# EAGLE design IEEE_EXT_Base_Centr (EAGLE 9.6.2)
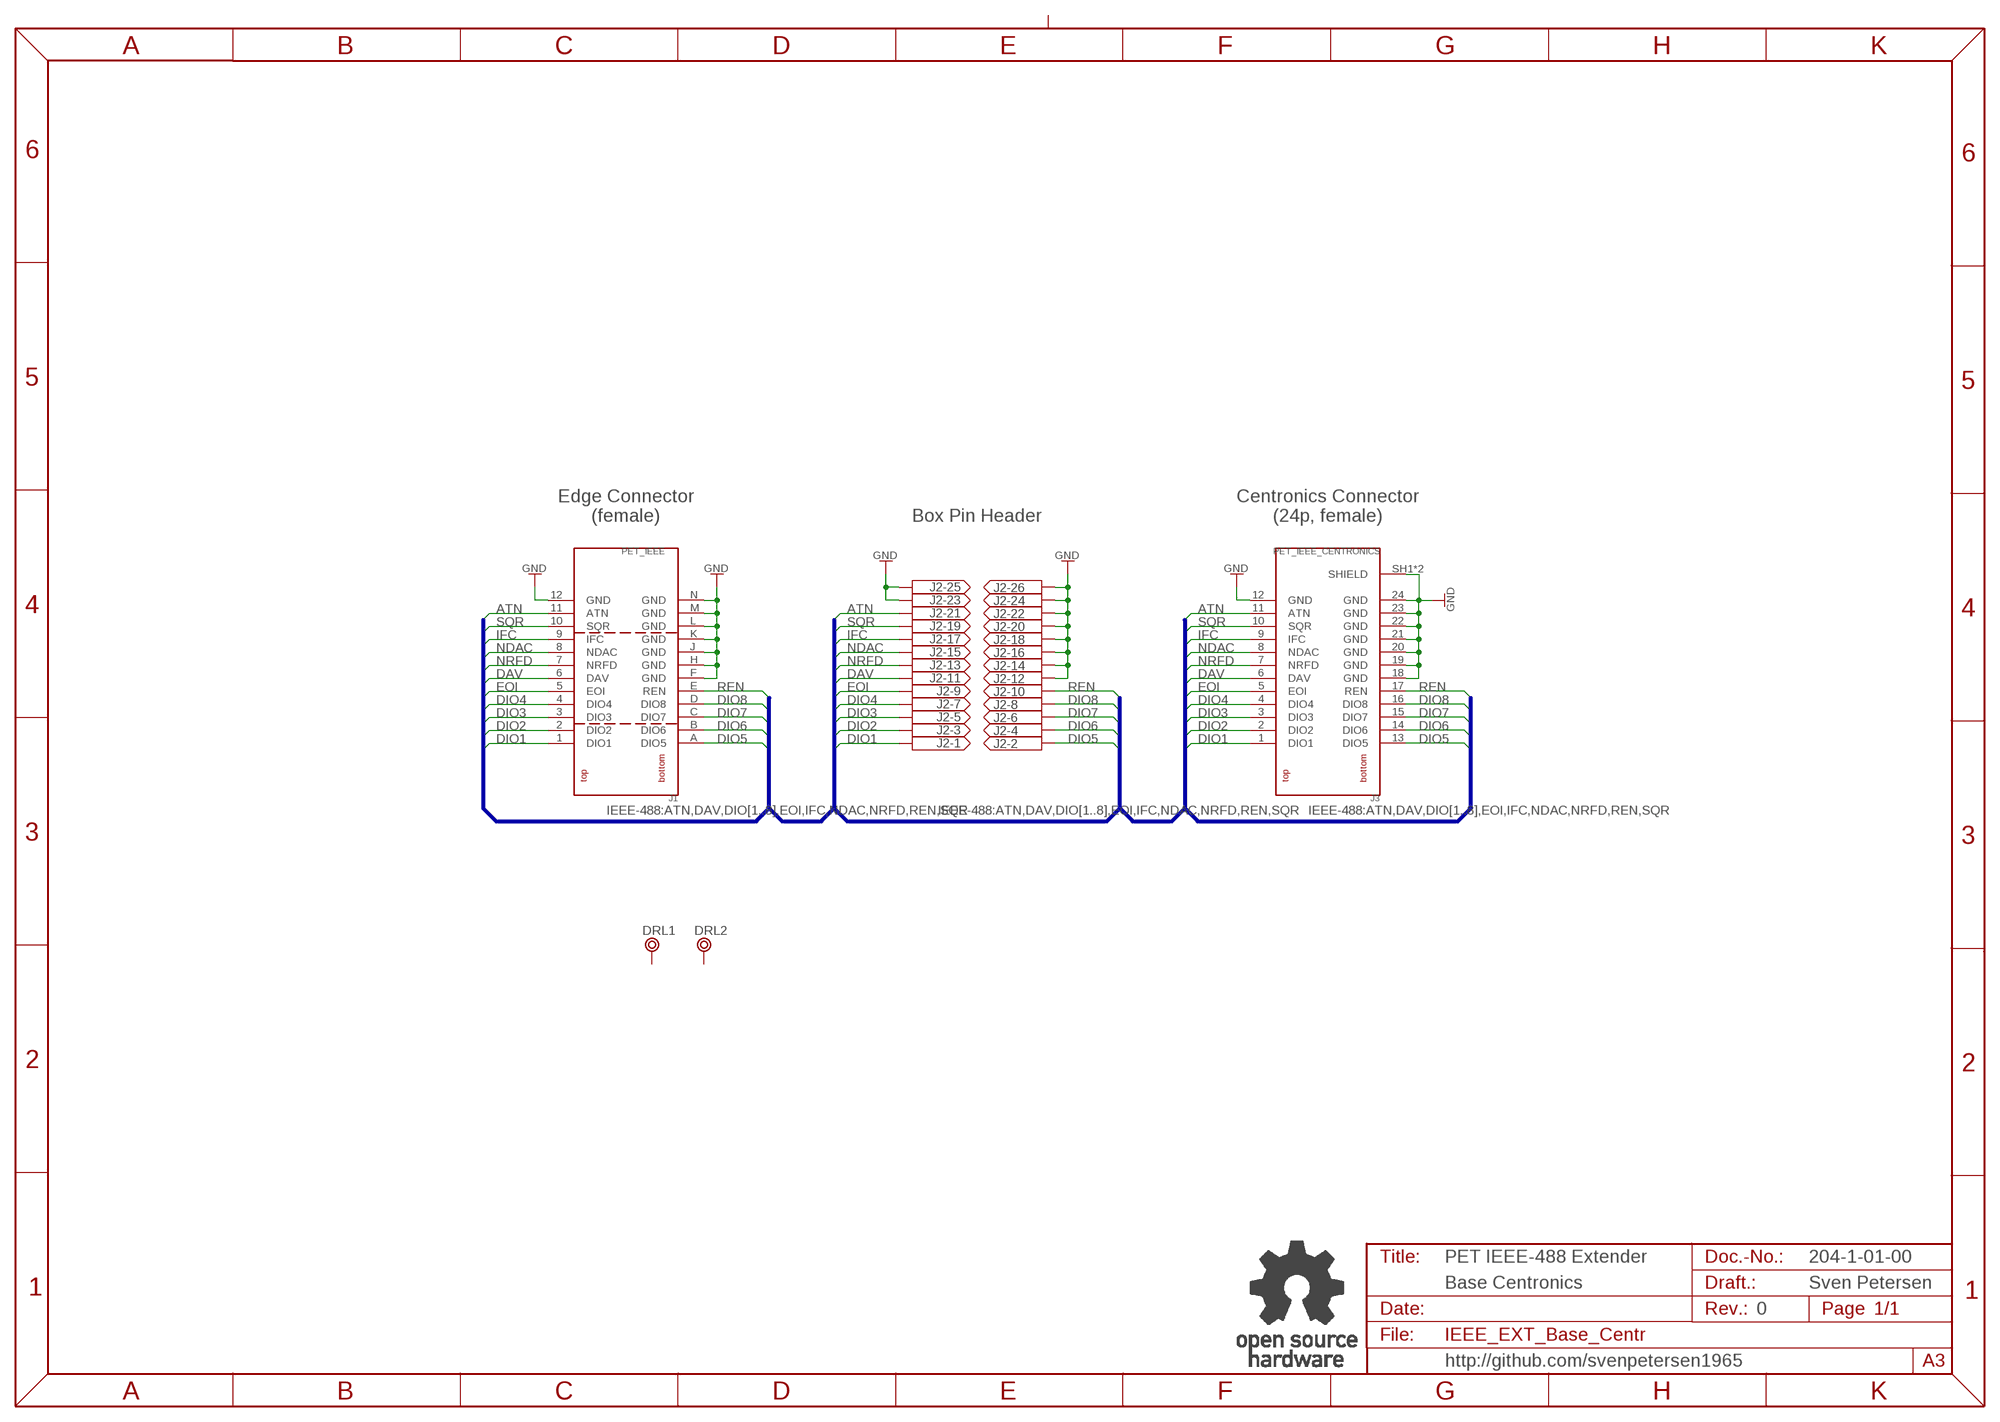
[diagram p0: schematic, sheet 1]

## Parts
DRL1  BOHR3,5  [BOHR3,5]
DRL2  BOHR3,5  [BOHR3,5]
J1  PET_IEEE  [USERPORT]
J2  2X13WANNE  [2X13WV]
J3  PET_IEEE_CENTRONICS  [CENTRONICS24]
U$9  OPEN_SOURCE_HW  [OPENHW]

## Nets
ATN: J1.11(ATN) J2.21 J3.11(ATN)
DAV: J1.6(DAV) J2.11 J3.6(DAV)
DIO1: J1.1(DIO1) J2.1 J3.1(DIO1)
DIO2: J1.2(DIO2) J2.3 J3.2(DIO2)
DIO3: J1.3(DIO3) J2.5 J3.3(DIO3)
DIO4: J1.4(DIO4) J2.7 J3.4(DIO4)
DIO5: J1.A(DIO5) J2.2 J3.13(DIO5)
DIO6: J1.B(DIO6) J2.4 J3.14(DIO6)
DIO7: J1.C(DIO7) J2.6 J3.15(DIO7)
DIO8: J1.D(DIO8) J2.8 J3.16(DIO8)
EOI: J1.5(EOI) J2.9 J3.5(EOI)
GND: J1.12(GND) J1.F(GND) J1.H(GND) J1.J(GND) J1.K(GND) J1.L(GND) J1.M(GND) J1.N(GND) J2.12 J2.14 J2.16 J2.18 J2.20 J2.22 J2.23 J2.24 J2.25 J2.26 J3.12(GND) J3.18(GND) J3.19(GND) J3.20(GND) J3.21(GND) J3.22(GND) J3.23(GND) J3.24(GND) J3.SH1(SHIELD) J3.SH2(SHIELD)
IFC: J1.9(IFC) J2.17 J3.9(IFC)
NDAC: J1.8(NDAC) J2.15 J3.8(NDAC)
NRFD: J1.7(NRFD) J2.13 J3.7(NRFD)
REN: J1.E(REN) J2.10 J3.17(REN)
SQR: J1.10(SQR) J2.19 J3.10(SQR)
Unconnected: DRL1.P$1 DRL2.P$1

## Buses
IEEE-488:ATN,DAV,DIO[1..8],EOI,IFC,NDAC,NRFD,REN,SQR

## Notes on the sheet
- Edge Connector
  (female)
- Box Pin Header
- Centronics Connector
  (24p, female)
- PET IEEE-488 Extender | 204-1-01-00
- Base Centronics | Sven Petersen
- 0
- http://github.com/svenpetersen1965

## Library data of the parts
DRL1 DRL2 = Mech_Bohr:BOHR3,5
J1 = Commodore:PET_IEEE
J2 = PINHEAD:2X13WANNE
J3 = Commodore:PET_IEEE_CENTRONICS
U$9 = Logo:OPEN_SOURCE_HW

## Board
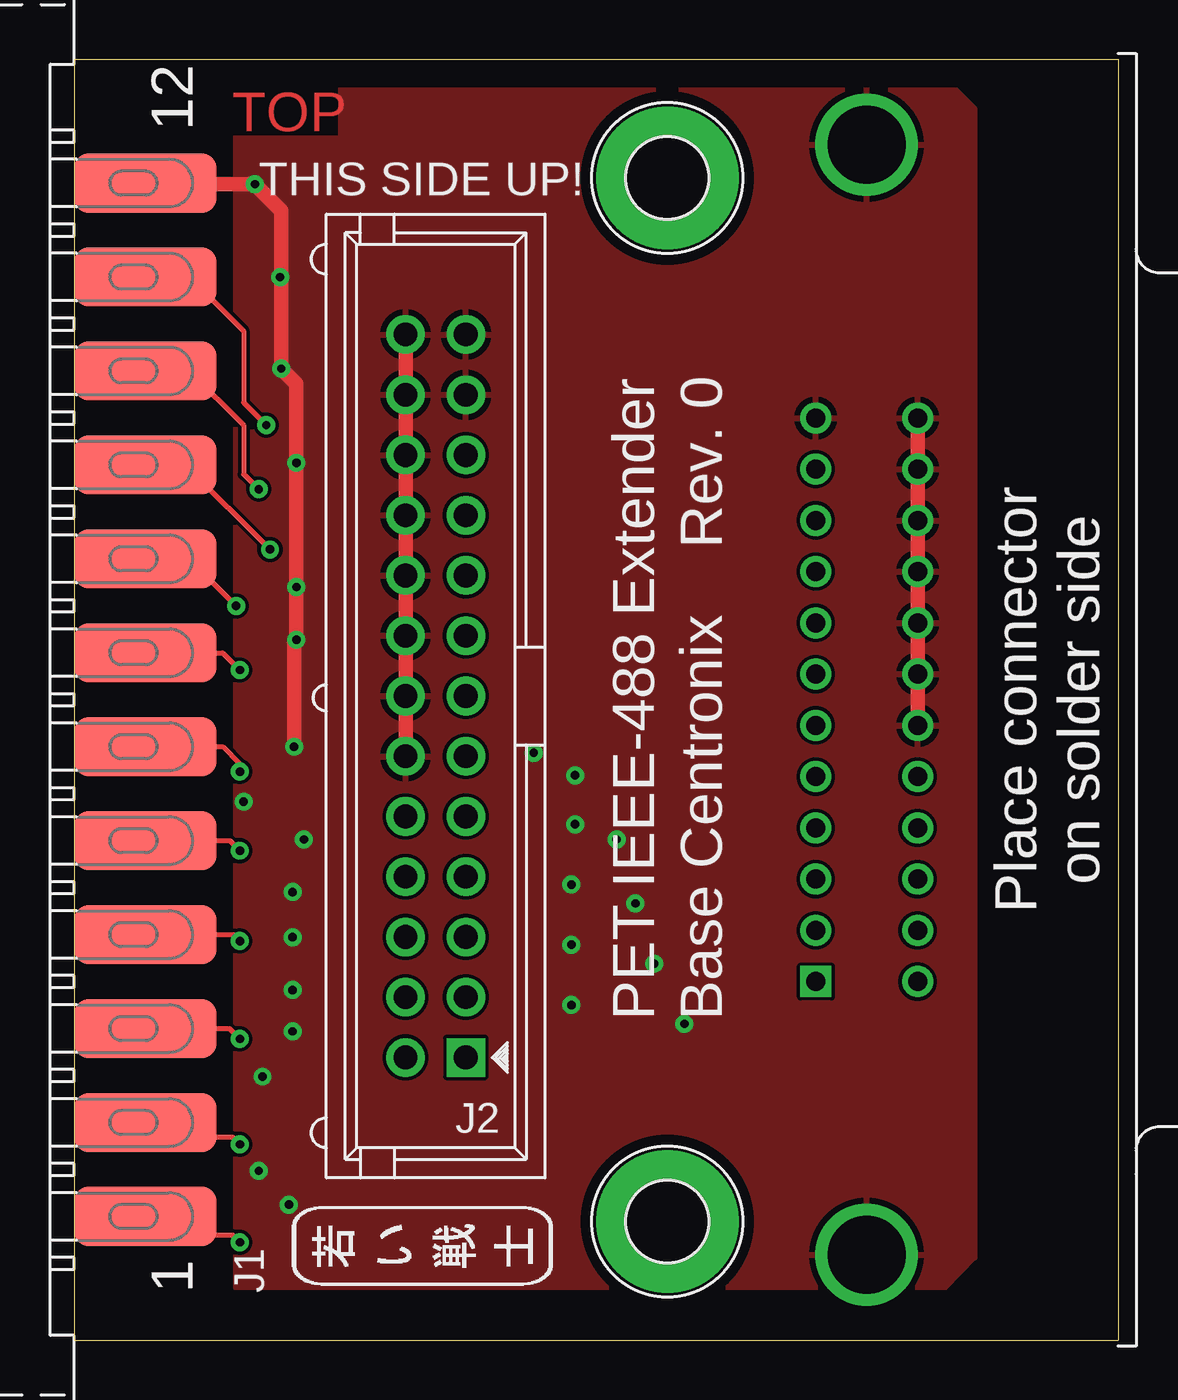
[diagram p1: board, top side]
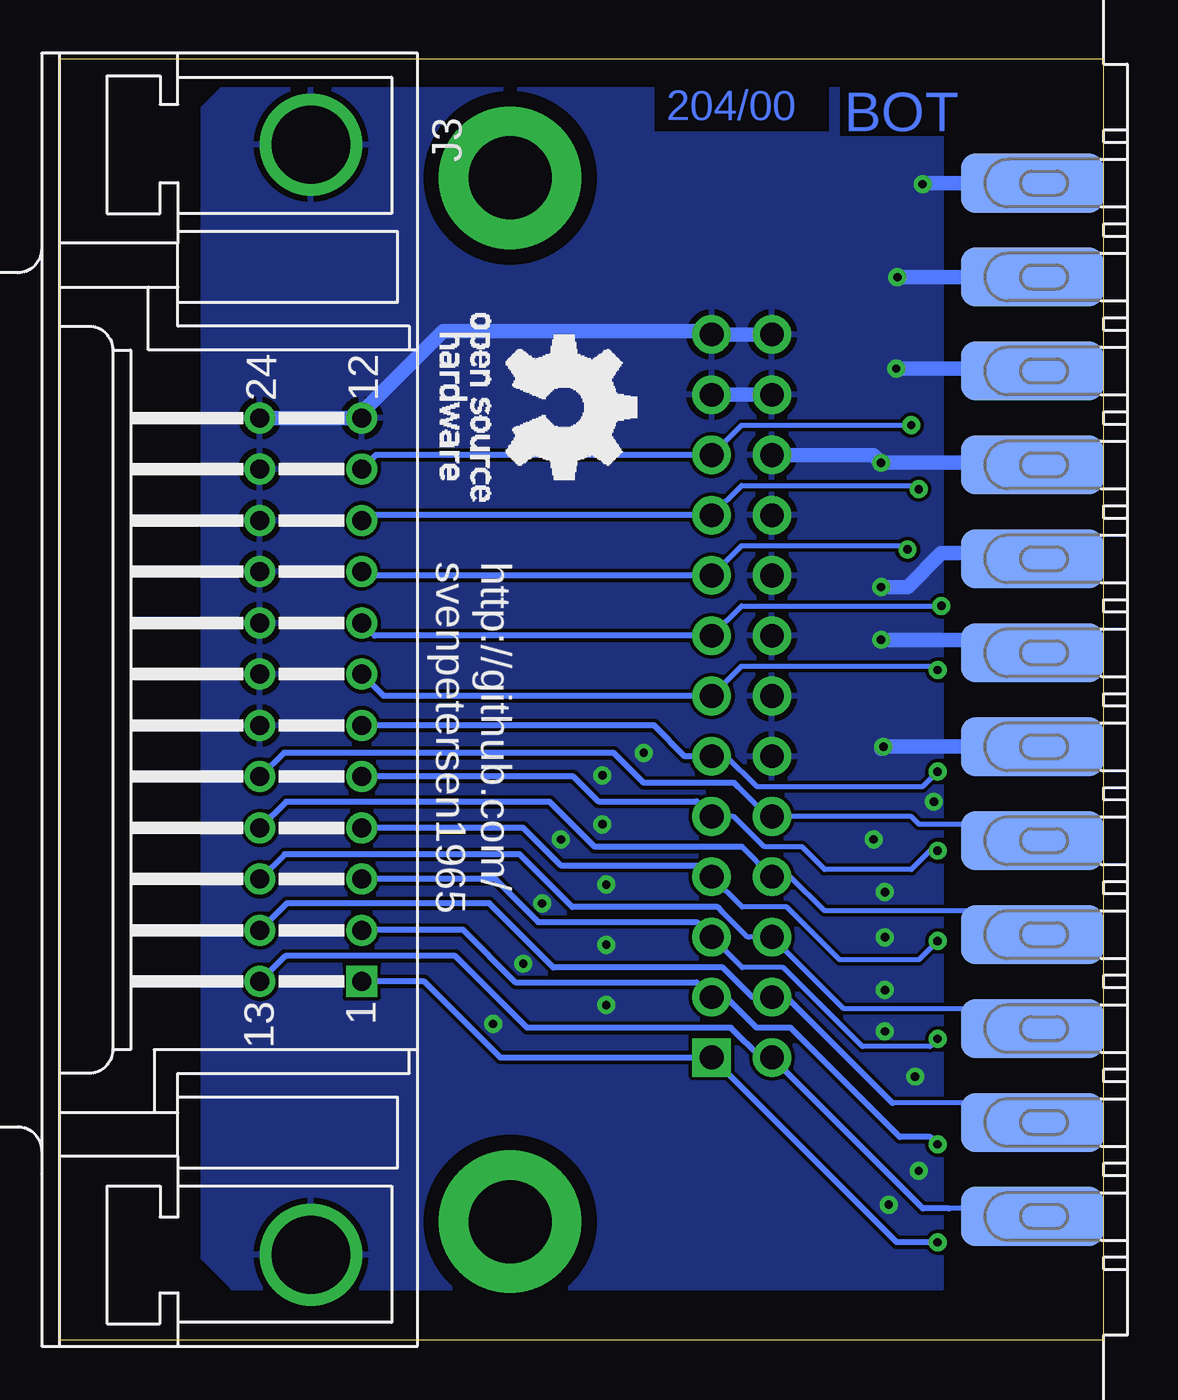
[diagram p2: board, bottom side, seen from below]

Size 44 x 54 mm. Coordinates in mm from the lower left corner, seen from the top.
Outline: 0,0 44,0 44,54 0,54 0,0
Copper layers (1*16): Top 0.035mm / dielectric 1.5mm / Bottom 0.035mm
Design rules "default *": minimum track width 6mil, minimum drill 0.35mm, track to track 6mil, track to pad 6mil, pad to pad 6mil, via to via 6mil, smd to smd 6mil, copper to edge 40mil, drill to drill 6mil, minimum pad ring 10mil, minimum via ring 8mil, stop-mask expansion 4mil, vias tented up to drill 25mil, thermal gap 10mil
bRestrict: 3 lines

### Footprints (pad centres in the part's own frame; a part is rotated, then mirrored left to right if it is on the bottom)
BOHR3,5 = drill 3.5 pad 6: P$1 0,0
USERPORT = smd 2.5 x 6: 1 -21.78,-3; 2 -17.82,-3; 3 -13.86,-3; 4 -9.9,-3; 5 -5.94,-3; 6 -1.98,-3; 7 1.98,-3; 8 5.94,-3; 9 9.9,-3; 10 13.86,-3; 11 17.82,-3; 12 21.78,-3 | smd 2.5 x 6 bottom: A -21.78,-3; B -17.82,-3; C -13.86,-3; D -9.9,-3; E -5.94,-3; F -1.98,-3; H 1.98,-3; J 5.94,-3; K 9.9,-3; L 13.86,-3; M 17.82,-3; N 21.78,-3
2X13WV = drill 1 pad 1.626 square: 1 -15.24,-1.27 | drill 1 pad 1.626: 2 -15.24,1.27; 3 -12.7,-1.27; 4 -12.7,1.27; 5 -10.16,-1.27; 6 -10.16,1.27; 7 -7.62,-1.27; 8 -7.62,1.27; 9 -5.08,-1.27; 10 -5.08,1.27; 11 -2.54,-1.27; 12 -2.54,1.27; 13 0,-1.27; 14 0,1.27; 15 2.54,-1.27; 16 2.54,1.27; 17 5.08,-1.27; 18 5.08,1.27; 19 7.62,-1.27; 20 7.62,1.27; 21 10.16,-1.27; 22 10.16,1.27; 23 12.7,-1.27; 24 12.7,1.27; 25 15.24,-1.27; 26 15.24,1.27
CENTRONICS24 = drill 0.8 square: 1 11.88,12.745 | drill 0.8: 2 9.72,12.745; 3 7.56,12.745; 4 5.4,12.745; 5 3.24,12.745; 6 1.08,12.745; 7 -1.08,12.745; 8 -3.24,12.745; 9 -5.4,12.745; 10 -7.56,12.745; 11 -9.72,12.745; 12 -11.88,12.745; 13 11.88,8.455; 14 9.72,8.455; 15 7.56,8.455; 16 5.4,8.455; 17 3.24,8.455; 18 1.08,8.455; 19 -1.08,8.455; 20 -3.24,8.455; 21 -5.4,8.455; 22 -7.56,8.455; 23 -9.72,8.455; 24 -11.88,8.455 | drill 3.3: SH1 -23.4,10.6; SH2 23.4,10.6

### Placement (x,y rotation side)
DRL1  25,5 0 top
DRL2  25,49 0 top
J1  0,27 90 top
J2  15.24,27.16 90 top
J3  44,27 270 bottom
U$8  [PCB-TITLE/]  0,68.42 0 top  (outside the outline)
U$9  27.95,43.27 270 bottom
U$10  [2LAYER]  6.64,50.96 0 top
U$11  [SVEN_TAG]  14.56,4.01 90 top

### Tracks (layer width: path | path; a pad name or v marks a point on that pad's centre or on a via)
ATN  (via drill 0.35)
  Top 0.203: J1.11 4.87,44.82 7.14,42.55 7.14,39.53 v8.1,38.58
  Bottom 0.203: v8.1,38.58 15.25,38.58 J2.21
  Bottom 0.254: J2.21 30.66,37.32 J3.11
DAV  (via drill 0.35)
  Top 0.203: J1.6 6.25,25.02 6.99,24.29 v6.99,23.97
  Bottom 0.203: v6.99,23.97 7.62,23.34 14.61,23.34 15.89,24.62 J2.11
  Bottom 0.254: J2.11 17.63,24.62 18.93,25.92 J3.6
DIO1  (via drill 0.35)
  Top 0.203: J1.1 3.79,4.43 6.69,4.43 v6.99,4.13
  Bottom 0.254: J3.1 28.61,15.12 25.41,11.92 J2.1 8.72,4.13 v6.99,4.13
DIO2  (via drill 0.35)
  Top 0.203: J1.2 3,8.75 3.17,8.57 6.67,8.57 v6.99,8.26
  Bottom 0.254: J3.2 31.23,17.3 26.99,17.3 24.78,15.09 17.14,15.09 J2.3 15.89,14.46 14.61,13.18 13.18,13.18 8.57,8.57 7.3,8.57 v6.99,8.26
DIO3  (via drill 0.35)
  Top 0.203: J1.3 6.54,13.14 v6.99,12.7
  Bottom 0.203: v6.99,12.7 7.3,12.38 10.16,12.38 10.64,12.86 13.49,15.72 15.22,15.72 J2.5
  Bottom 0.254: J2.5 17.14,17.63 23.82,17.63 25.63,19.44 J3.3
DIO4  (via drill 0.35)
  Top 0.203: J1.4 6.71,17.1 v6.99,16.83
  Bottom 0.203: v6.99,16.83 7.78,16.03 11.11,16.03 12.06,16.99 13.34,18.26 15.22,18.26 J2.7
  Bottom 0.254: J2.7 16.98,20.02 22.87,20.02 24.46,21.6 J3.4
DIO5
  Bottom 0.203: J1.A 3.34,5.56 6.51,5.56
  Bottom 0.254: J3.13 34.47,16.19 27.3,16.19 24.29,13.18 15.7,13.18 14.44,11.92 J2.2 7.61,5.56 6.51,5.56
DIO6
  Bottom 0.203: J1.B 3.02,9.21 3.81,10 8.89,10
  Bottom 0.254: J3.14 34.41,18.41 25.88,18.41 23.18,15.72 16.03,15.72 14.78,14.46 J2.4 13.35,14.46 8.89,10
DIO7
  Bottom 0.203: J1.C 3.83,13.97 10.94,13.97 J2.6 14.91,17 14.92,16.99 14.99,16.99 16.07,18.07
  Bottom 0.254: 16.07,18.07 16.26,18.26 22.38,18.26 24.61,20.48 34.51,20.48 J3.15
DIO8
  Bottom 0.203: J1.D 4.72,17.1 5.71,18.1 11.75,18.1 13.19,19.54 J2.8 15.22,20.8
  Bottom 0.254: J3.16 34.44,22.7 23.34,22.7 21.43,20.8 15.22,20.8
EOI  (via drill 0.35)
  Top 0.203: J1.5 6.56,21.06 v6.99,20.64
  Bottom 0.203: v6.99,20.64 7.3,20.64 8.1,19.84 11.75,19.84 12.7,20.8 14.29,20.8 15.57,22.08 J2.9
  Bottom 0.254: J2.9 17.14,22.71 21.29,22.71 22.33,23.76 J3.5
GND  (via drill 0.35)
  Top 0.61: J2.12 J2.14 J2.16 J2.18 J2.20 J2.22 J2.24 J2.26 | J1.N 3.04,48.74 v7.62,48.74 8.73,47.62 8.73,44.77 | 8.73,44.77 v8.68,44.82 | 8.73,44.77 v8.73,40.96 9.37,40.32 v9.37,36.99 v9.37,31.75 v9.37,29.53 9.27,29.43 v9.27,25.02 | J3.24 J3.23 J3.22 J3.21 J3.20 J3.19 J3.18
  Bottom 0.61: J2.24 J2.23 | J2.26 J2.25 16.65,42.55 27.81,42.55 31.25,39.1 J3.12 J3.24 | J1.N 7.58,48.78 v7.62,48.74 | J1.M v8.68,44.82 8.73,44.77 | J1.L 3.1,40.96 v8.73,40.96 | J1.K 3.09,36.99 v9.37,36.99 9.7,37.32 J2.22 | J1.J 3.24,33.18 6.83,33.18 8.26,31.75 v9.37,31.75 | J1.H 3.55,29.53 v9.37,29.53 | J1.F v9.27,25.02 9.37,24.92
  other vias: 9.21,14.76 9.21,18.89 7.14,22.7 9.68,21.11 9.21,16.99 9.21,13.02 7.94,11.11 7.78,7.14 9.05,5.71 19.37,24.77 21.11,21.75 20.95,19.21 20.95,16.67 20.95,14.13 21.11,23.81 22.86,21.11 23.65,18.41 24.45,15.88 25.72,13.34
  pour Top: 6.83,52.7 37.15,52.7 37.94,51.91 37.94,3.49 36.68,2.21 28.67,2.22 6.83,2.22
  pour Bottom: 6.83,52.7 37.15,52.7 37.94,51.91 37.94,3.49 36.67,2.22 36.68,2.21 28.67,2.22 6.83,2.22
IFC  (via drill 0.35)
  Top 0.203: J1.9 4.69,36.9 v8.26,33.34
  Bottom 0.203: v8.26,33.34 8.41,33.5 15.25,33.5 J2.17
  Bottom 0.254: J2.17 31.09,32.24 J3.9
NDAC  (via drill 0.35)
  Top 0.203: J1.8 4.84,32.94 v6.83,30.96
  Bottom 0.203: v6.83,30.96 15.25,30.96 J2.15
  Bottom 0.254: J2.15 30.71,29.7 J3.8
NRFD  (via drill 0.35)
  Top 0.203: J1.7 6.26,28.98 v6.99,28.26
  Bottom 0.203: v6.99,28.26 7.14,28.42 15.25,28.42 J2.13
  Bottom 0.254: J2.13 30.33,27.16 J3.7
REN
  Bottom 0.203: J1.E 4.87,21.06 5.57,21.76 7.78,21.76 8.09,22.08 J2.10 14.14,22.08 15.4,23.34
  Bottom 0.254: 15.4,23.34 15.56,23.5 19.37,23.5 20.64,24.77 34.54,24.77 J3.17
SQR  (via drill 0.35)
  Top 0.203: J1.10 4.86,40.86 7.14,38.58 7.14,36.51 v7.78,35.88
  Bottom 0.203: v7.78,35.88 7.94,36.04 15.25,36.04 J2.19
  Bottom 0.254: J2.19 31.04,34.78 J3.10

### Text on the board
Bottom: 204/00
tPlace: 12 | Rev. 0 | PET IEEE-488 Extender | Base Centronix | 1
bPlace: http://github.com/ / svenpetersen1965
tNames: THIS SIDE UP! | Place connector / on solder side
Document: 204-2-01-00 | Sven Petersen / 2022 | 35µm | 2 | 0